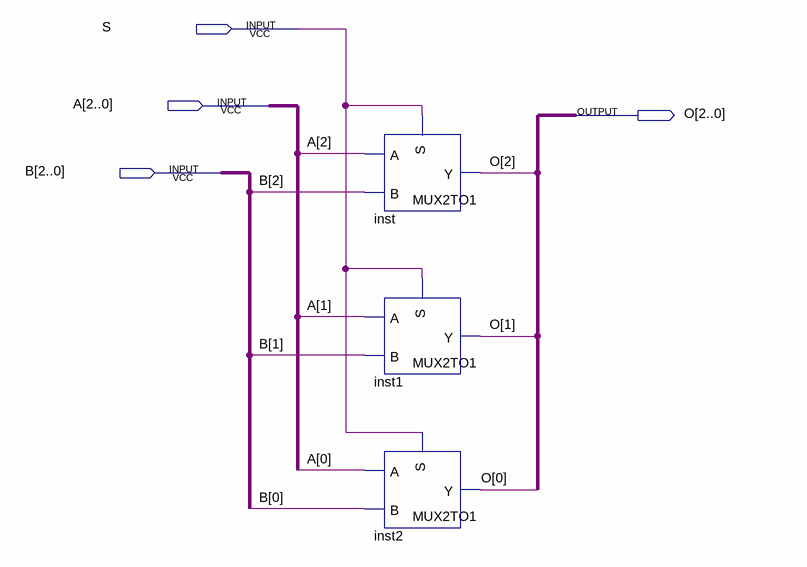
[diagram p0: schematic sheet]
// Quartus schematic MUX2TO13BIT.bdf as structural Verilog: 3 symbols, 4 pins
module MUX2TO13BIT (
  input  S,
  input  [2:0] A,
  input  [2:0] B,
  output [2:0] O
);

  MUX2TO1 inst (.S(S), .A(A[2]), .B(B[2]), .Y(O[2]));
  MUX2TO1 inst1 (.S(S), .A(A[1]), .B(B[1]), .Y(O[1]));
  MUX2TO1 inst2 (.S(S), .A(A[0]), .B(B[0]), .Y(O[0]));
endmodule
